# EAGLE design pogo (EAGLE 5.11)
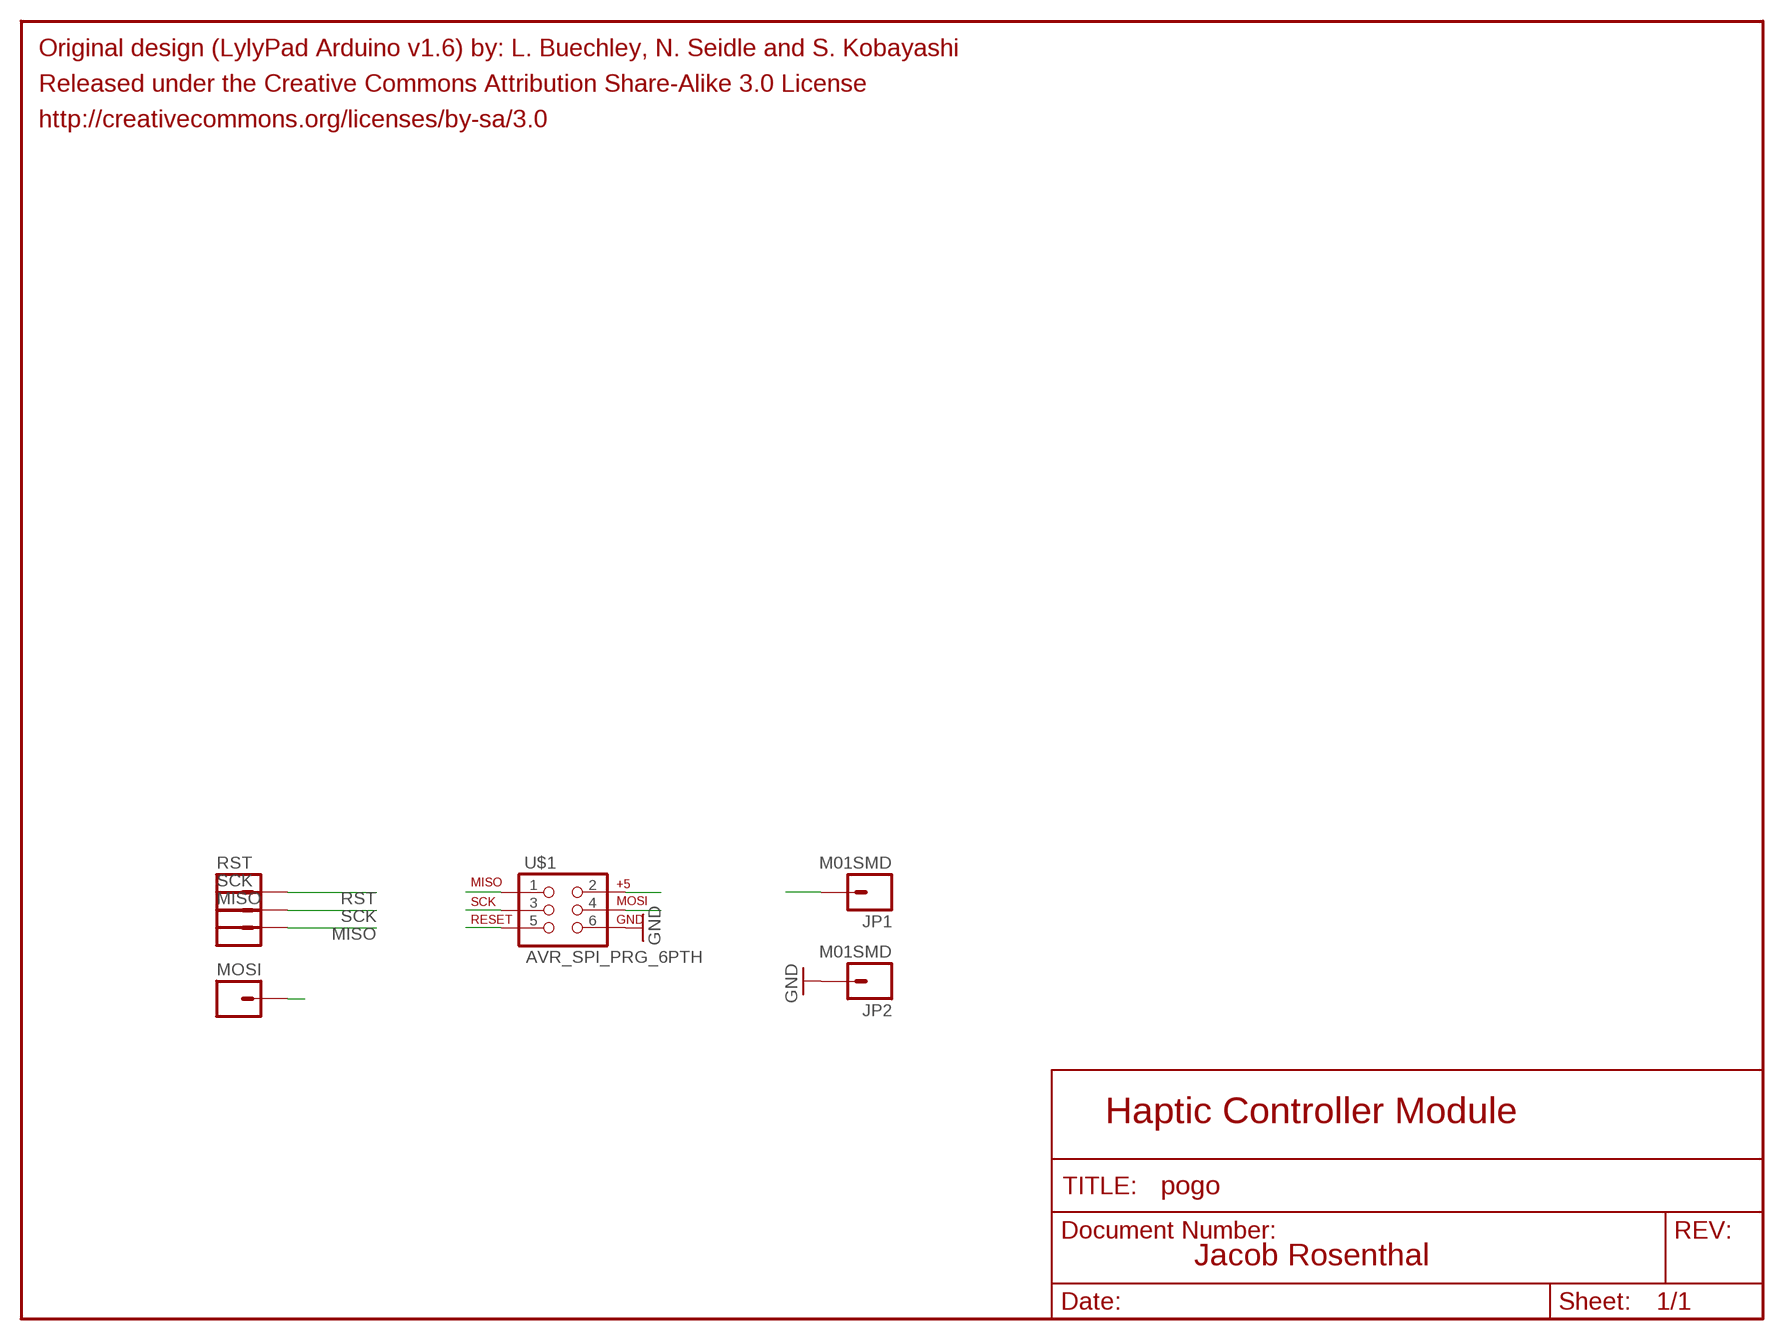
[diagram p0: schematic, sheet 1]

## Parts
JP1  M01SMD  [LUXEON-PAD]
JP2  M01SMD  [LUXEON-PAD]
MISO  M01SMD-4.5X1.5  [PAD-1.5X4.5]
MOSI  M01SMD-4.5X1.5  [PAD-1.5X4.5]
RST  M01SMD-4.5X1.5  [PAD-1.5X4.5]
SCK  M01SMD-4.5X1.5  [PAD-1.5X4.5]
U$1  AVR_SPI_PRG_6PTH  [2X3]

## Nets
GND: JP2.P$1 U$1.6
MISO: MISO.P$1 U$1.1
MOSI: MOSI.P$1 U$1.4
RST: RST.P$1 U$1.5
SCK: SCK.P$1 U$1.3
VIN: JP1.P$1 U$1.2

## Notes on the sheet
- Original design (LylyPad Arduino v1.6) by: L. Buechley, N. Seidle and S. Kobayashi
- Released under the Creative Commons Attribution Share-Alike 3.0 License
- http://creativecommons.org/licenses/by-sa/3.0
- Haptic Controller Module
- Jacob Rosenthal

## Library data of the parts
JP1 JP2 = haptic-controller:M01: Header 1
MISO MOSI RST SCK = SparkFun:M01: Header 1
U$1 = SparkFun:AVR_SPI_PRG_6: AVR ISP 6 Pin This is the reduced ISP connector for AVR programming. Common on Arduino. This footprint will take up less PCB space and can be used with a 10-pin to 6-pin adapter such as SKU: BOB-08508

## Net classes
0 Default: width 0.203 mm
1 VCC: width 0.701 mm
2 LEDPower: width 0.203 mm
3 ButtonSignal: width 0.203 mm
4 Bus: width 0.508 mm

## Board
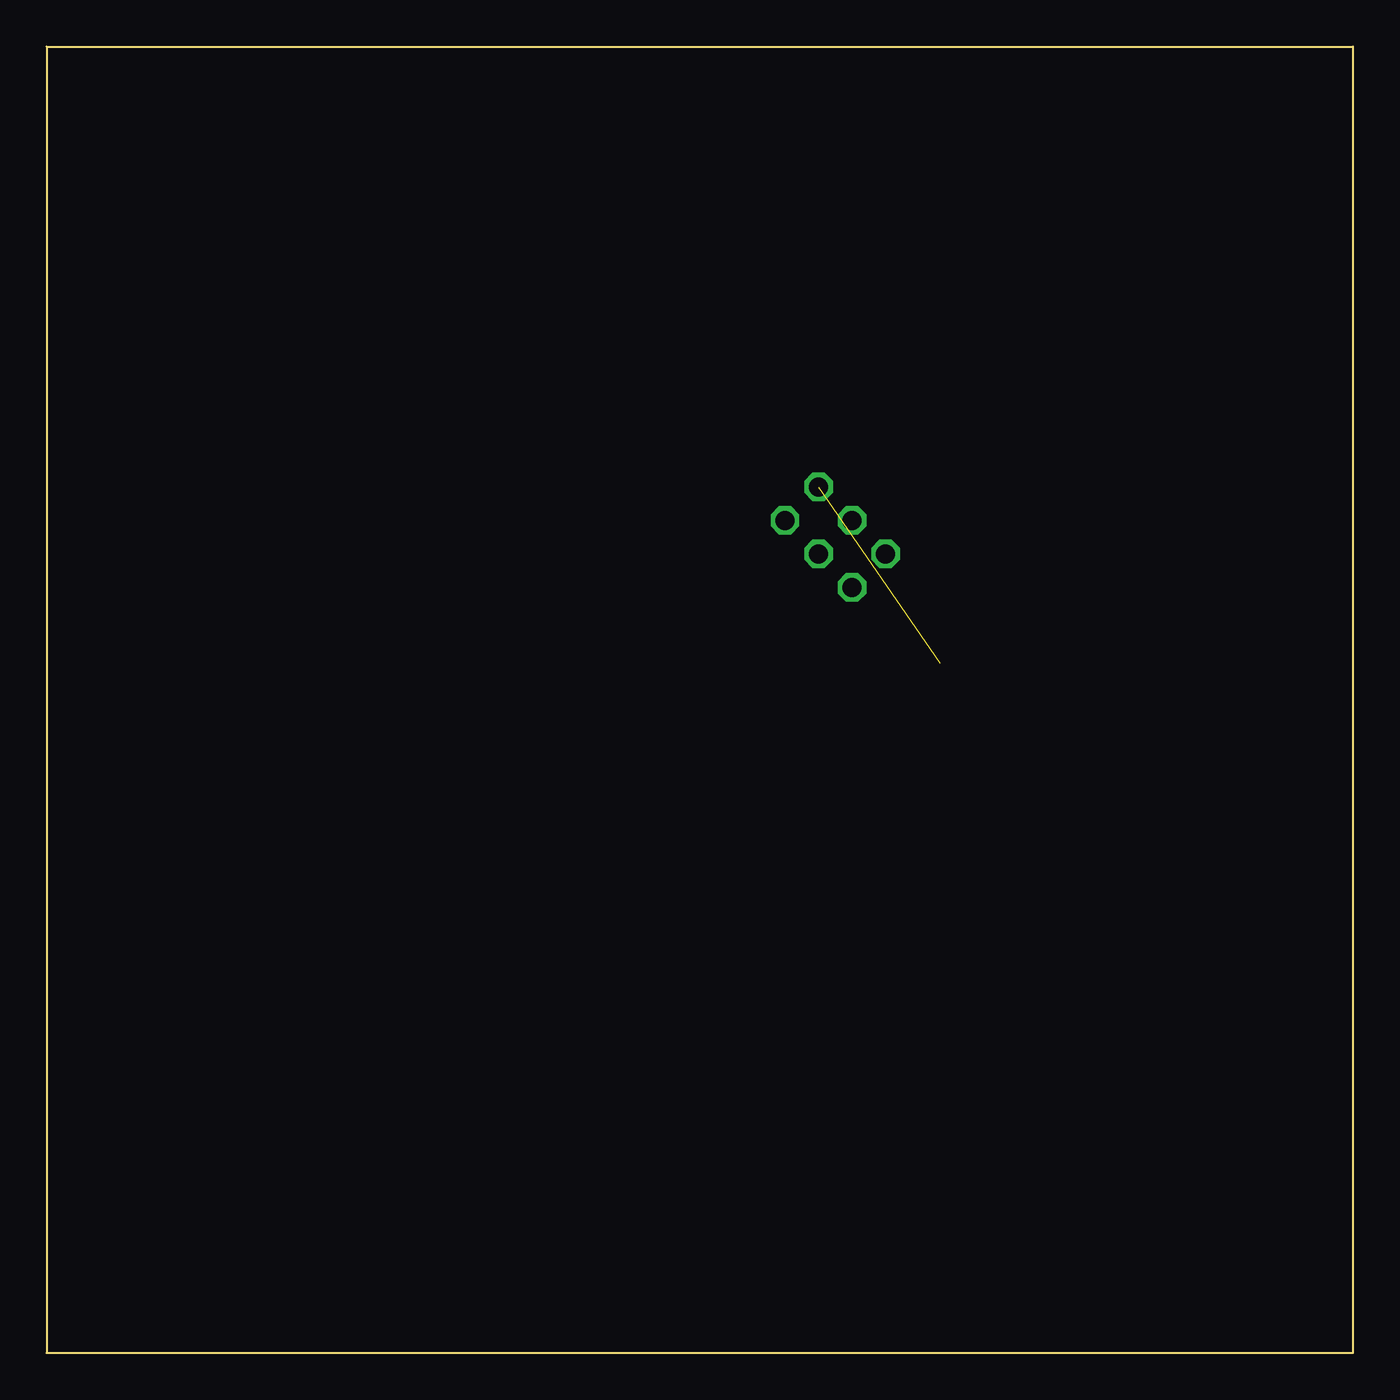
[diagram p1: board, top side]
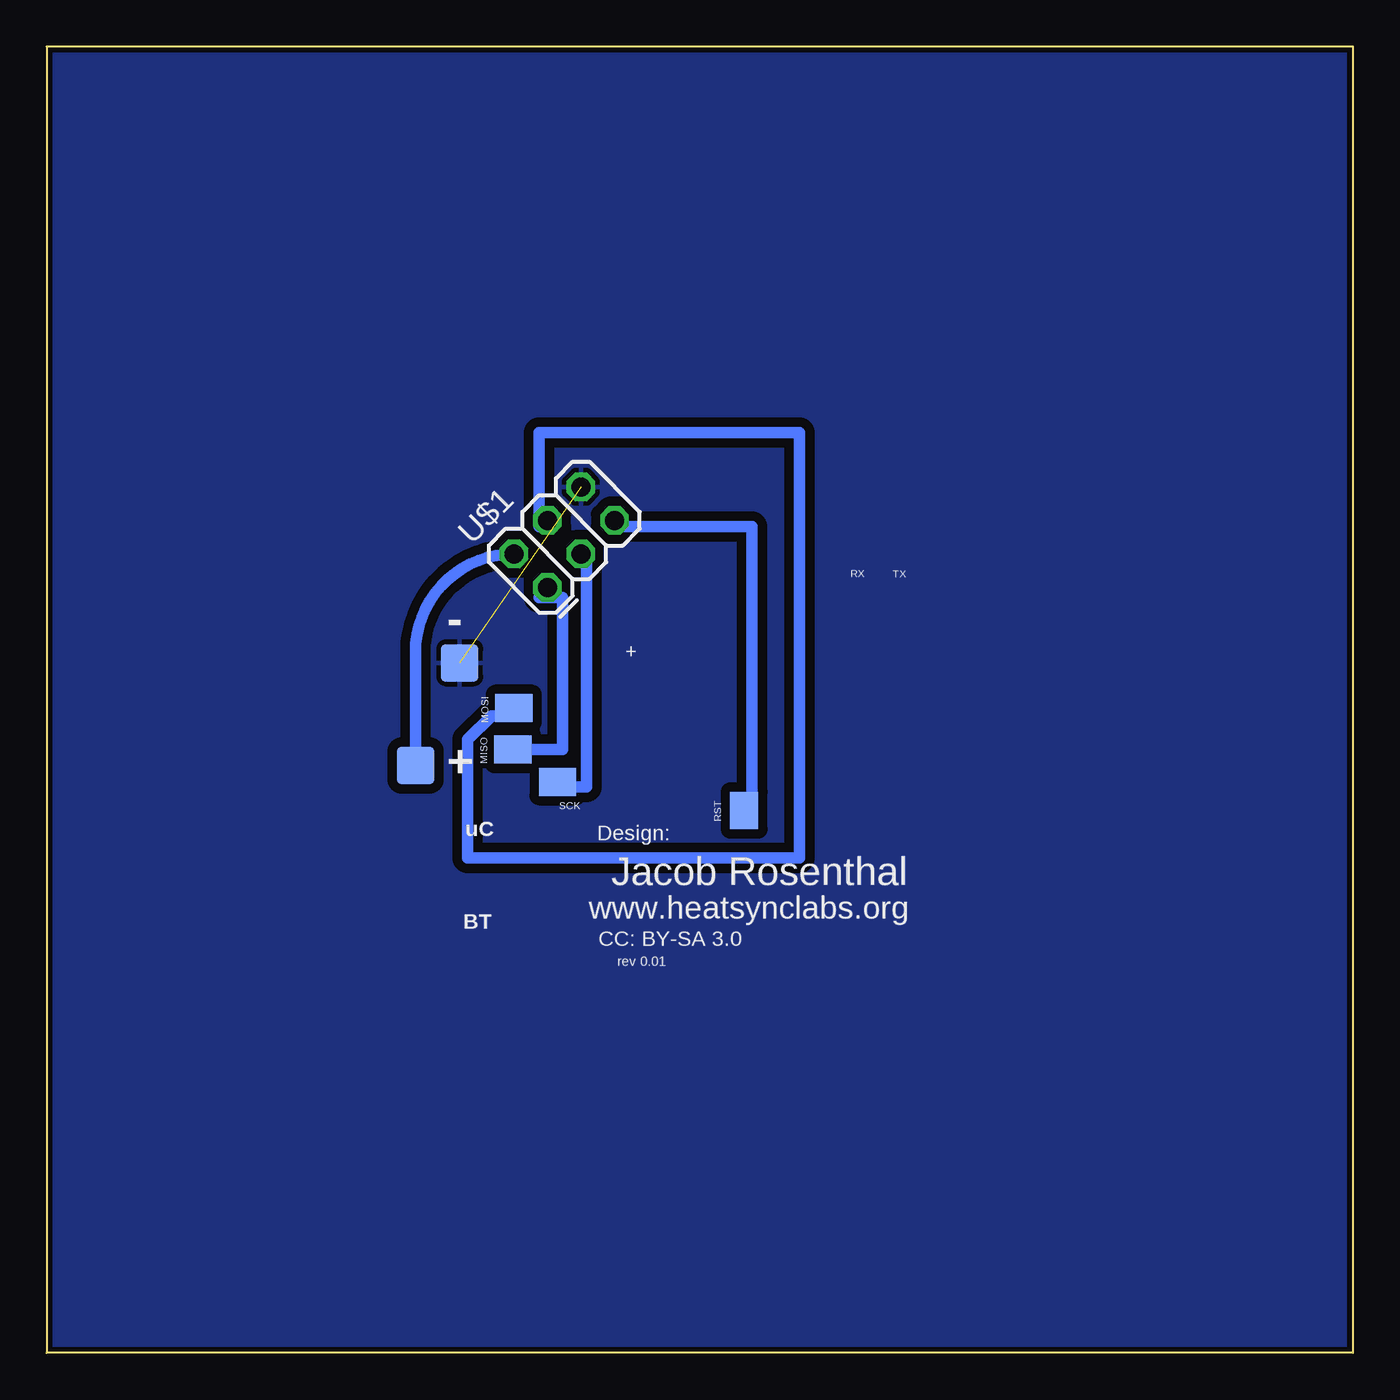
[diagram p2: board, bottom side, seen from below]

Size 70 x 70 mm. Coordinates in mm from the lower left corner, seen from the top.
Outline: 0,0 70,0 70,70 0,70 0,0
Copper layers (1*16): Top 0.035mm / dielectric 1.5mm / Bottom 0.035mm
Design rules "Fusion_eagle_rule_v1.1 *": minimum track width 24mil, minimum drill 24mil, track to track 20mil, track to pad 20mil, pad to pad 20mil, via to via 20mil, smd to smd 0mil, copper to edge 10mil, drill to drill 10mil, minimum pad ring 10mil, minimum via ring 6mil, stop-mask expansion 2mil, vias tented up to drill 100mil, thermal gap 10mil

### Footprints (pad centres in the part's own frame; a part is rotated, then mirrored left to right if it is on the bottom)
LUXEON-PAD = smd 2 x 2: P$1 0,0
PAD-1.5X4.5 = smd 1.5 x 2: P$1 0,0
2X3 = drill 1.016 octagon: 1 0,0; 2 0,2.54; 3 2.54,0; 4 2.54,2.54; 5 5.08,0; 6 5.08,2.54

### Placement (x,y rotation side)
JP1  50.24,31.48 90 bottom
JP2  47.86,36.98 270 bottom
MISO  45.01,32.33 270 bottom
MOSI  44.96,34.55 90 bottom
RST  32.62,29.07 180 bottom
SCK  42.62,30.6 270 bottom
U$1  43.16,41.02 45 bottom

### Tracks (layer width: path | path; a pad name or v marks a point on that pad's centre or on a via)
GND  (1 unrouted)
  pour Bottom: -2.86,72.22 73.14,71.22 72.14,-1.78 -1.86,-0.78
MISO
  Bottom 0.61: U$1.1 43.62,40.48 42.35,40.48 42.35,32.33 MISO.P$1
MOSI
  Bottom 0.61: MOSI.P$1 44.89,34.13 46.16,34.13 47.43,32.86 47.43,26.51 29.65,26.51 29.65,49.31 43.62,49.31 43.62,44.29 U$1.4
RST
  Bottom 0.61: RST.P$1 32.19,29.05 32.19,44.29 39.81,44.29 U$1.5
SCK
  Bottom 0.61: SCK.P$1 42.35,30.32 41.08,30.32 41.08,43.02 U$1.3
VIN
  Bottom 0.61: U$1.2 arc-90 50.24,37.53 JP1.P$1

### Text on the board
bPlace: - | + | + | uC | Design: | Jacob Rosenthal | www.heatsynclabs.org | BT | CC: BY-SA 3.0 | rev 0.01
bNames: TX | RX | MOSI | MISO | SCK | RST